# Altium project ATTINY.PrjPcb
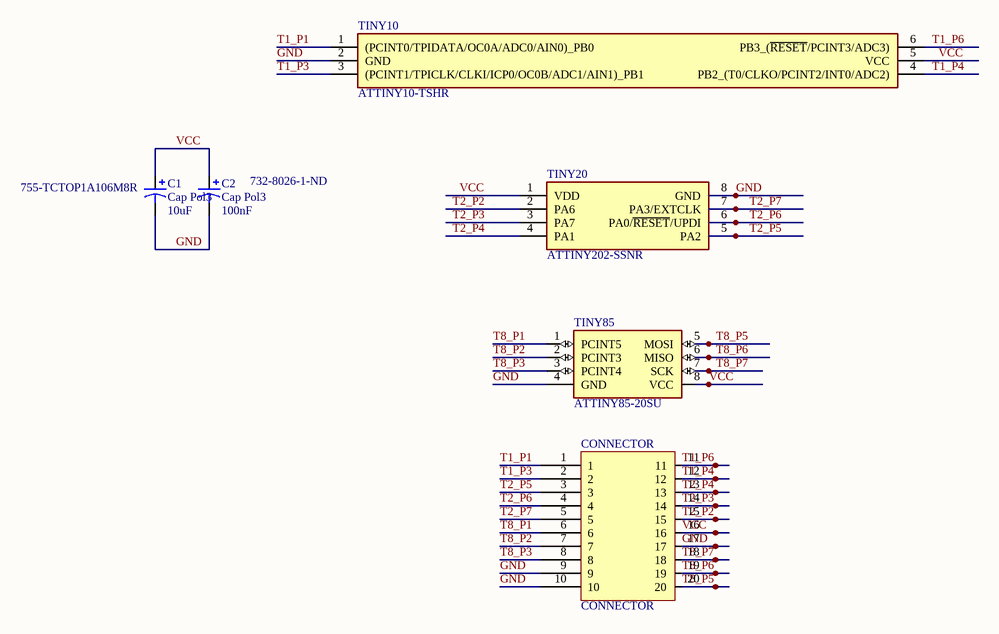
[diagram p0: MCU.SchDoc]
1 sheet, 6 parts. Net scope: global (net labels, ports and power ports of the same name join across sheets).
Board file: proto_board.PcbDoc

## Sheet MCU.SchDoc
size A4

### Parts
C1  Cap Pol3  value 10uF  Supplier Part Number 1: 755-TCTOP1A106M8R  [C0805]
C2  Cap Pol3  value 100nF  Supplier Part Number 1: 732-8026-1-ND  [C0805]
CONNECTOR  CONNECTOR  [PIN_HEADER]
TINY10  ATTINY10-TSHR  [SOT95P280X145-6N]
TINY20  ATTINY202-SSNR  [SOIC127P600X175-8N]
TINY85  ATTINY85-20SU  [SOT127P798X216-8N]

### Nets
GND: C1.2 C2.2 CONNECTOR.9 CONNECTOR.10 CONNECTOR.17 TINY10.2(GND) TINY20.8(GND) TINY85.4(GND)
T1_P1: CONNECTOR.1 TINY10.1((PCINT0/TPIDATA/OC0A/ADC0/AIN0)_PB0)
T1_P3: CONNECTOR.2 TINY10.3((PCINT1/TPICLK/CLKI/ICP0/OC0B/ADC1/AIN1)_PB1)
T1_P4: CONNECTOR.12 TINY10.4(PB2_(T0/CLKO/PCINT2/INT0/ADC2))
T1_P6: CONNECTOR.11 TINY10.6(PB3_(~{RESET}/PCINT3/ADC3))
T2_P2: CONNECTOR.15 TINY20.2(PA6)
T2_P3: CONNECTOR.14 TINY20.3(PA7)
T2_P4: CONNECTOR.13 TINY20.4(PA1)
T2_P5: CONNECTOR.3 TINY20.5(PA2)
T2_P6: CONNECTOR.4 TINY20.6(PA0/~{RESET}/UPDI)
T2_P7: CONNECTOR.5 TINY20.7(PA3/EXTCLK)
T8_P1: CONNECTOR.6 TINY85.1(PCINT5)
T8_P2: CONNECTOR.7 TINY85.2(PCINT3)
T8_P3: CONNECTOR.8 TINY85.3(PCINT4)
T8_P5: CONNECTOR.20 TINY85.5(MOSI)
T8_P6: CONNECTOR.19 TINY85.6(MISO)
T8_P7: CONNECTOR.18 TINY85.7(SCK)
VCC: C1.1 C2.1 CONNECTOR.16 TINY10.5(VCC) TINY20.1(VDD) TINY85.8(VCC)

### Library data of the parts
C1 C2 = Cap Pol3: Polarized Capacitor (Surface Mount); Published: 8-Jun-2000; LatestRevisionDate: 29-May-2009; LatestRevisionNote: IPC-7351 Footprint Added.; PackageReference: C0805; Publisher: Altium Limited; PackageDescription: Chip Capacitor
  C1: Supplier 1: Mouser
  C2: Supplier 1: Digi-Key
TINY10 = ATTINY10-TSHR: Integrated Circuit; Manufacturer_Name: Microchip; Datasheet Link: http://www.atmel.com/images/atmel-8127-avr-8-bit-microcontroller-attiny4-attiny5-attiny9-attiny10_datasheet.pdf; Height: 1.45mm; Manufacturer_Part_Number: ATTINY10-TSHR; Mouser Part Number: 556-ATTINY10-TSHR; Mouser Price/Stock: https://www.mouser.co.uk/ProductDetail/Microchip-Technology-Atmel/ATTINY10-TSHR?qs=3unH%2FDqlvl%2FoduNsVj6acA%3D%3D; RS Part Number: 1330946P; RS Price/Stock: http://uk.rs-online.com/web/p/products/1330946P
TINY20 = ATTINY202-SSNR: Integrated Circuit; Manufacturer_Name: Microchip; Datasheet Link: http://ww1.microchip.com/downloads/en/DeviceDoc/ATtiny202-402-AVR-MCU-with-Core-Independent-Peripherals_and-picoPower-40001969A.pdf; Height: 1.75mm; Manufacturer_Part_Number: ATTINY202-SSNR; Mouser Part Number: 579-ATTINY202-SSNR; Mouser Price/Stock: https://www.mouser.co.uk/ProductDetail/Microchip-Technology/ATTINY202-SSNR?qs=y6ZabgHbY%252Bx90fzudZ0SuA%3D%3D
TINY85 = ATTINY85-20SU: Integrated Circuit; Manufacturer_Name: Microchip; Datasheet Link: https://componentsearchengine.com/Datasheets/2/ATTINY85-20SU.pdf; Height: 2.16mm; Manufacturer_Part_Number: ATTINY85-20SU; Mouser Part Number: 556-ATTINY85-20SU; Mouser Price/Stock: https://www.mouser.co.uk/ProductDetail/Microchip-Technology-Atmel/ATTINY85-20SU?qs=8jWQYweyg6N%2FGXnwAe4Icw%3D%3D; RS Part Number: 6962639P; RS Price/Stock: http://uk.rs-online.com/web/p/products/6962639P